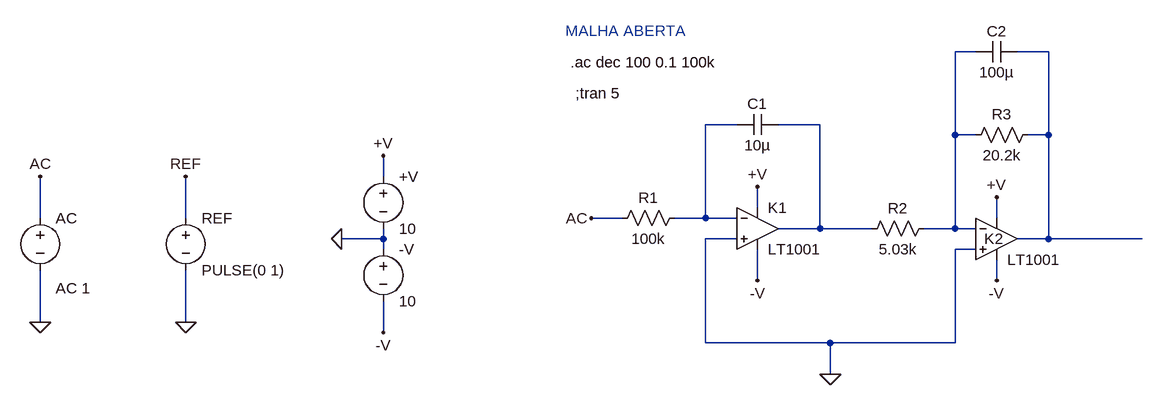
[diagram p0: schematic OL.asc]
OL.asc, the LTspice schematic file:
Version 4
SHEET 1 1780 680
WIRE 400 -64 368 -64
WIRE 512 -64 464 -64
WIRE 32 48 -16 48
WIRE 160 48 96 48
WIRE 368 64 368 -64
WIRE 400 64 368 64
WIRE 512 64 512 -64
WIRE 512 64 480 64
WIRE -512 128 -512 96
WIRE 64 176 64 144
WIRE -1040 192 -1040 128
WIRE -816 192 -816 128
WIRE -144 192 -192 192
WIRE -16 192 -16 48
WIRE -16 192 -64 192
WIRE 32 192 -16 192
WIRE 432 192 432 160
WIRE 160 208 160 48
WIRE 160 208 96 208
WIRE 240 208 160 208
WIRE 368 208 368 64
WIRE 368 208 320 208
WIRE 400 208 368 208
WIRE -512 224 -512 208
WIRE -512 224 -576 224
WIRE 32 224 -16 224
WIRE 512 224 512 64
WIRE 512 224 464 224
WIRE 656 224 512 224
WIRE -512 240 -512 224
WIRE 400 240 368 240
WIRE 64 288 64 240
WIRE 432 288 432 256
WIRE -1040 352 -1040 272
WIRE -816 352 -816 272
WIRE -512 368 -512 320
WIRE -16 384 -16 224
WIRE 176 384 -16 384
WIRE 368 384 368 240
WIRE 368 384 176 384
WIRE 176 432 176 384
FLAG -512 96 +V
FLAG -512 368 -V
FLAG -576 224 0
FLAG -816 352 0
FLAG -816 128 REF
FLAG -192 192 AC
FLAG 64 144 +V
FLAG 432 160 +V
FLAG 64 288 -V
FLAG 432 288 -V
FLAG 176 432 0
FLAG -1040 352 0
FLAG -1040 128 AC
SYMBOL voltage -512 112 R0
WINDOW 123 0 0 Left 2
WINDOW 39 0 0 Left 2
SYMATTR InstName +V
SYMATTR Value 10
SYMBOL voltage -512 224 R0
WINDOW 123 0 0 Left 2
WINDOW 39 0 0 Left 2
SYMATTR InstName -V
SYMATTR Value 10
SYMBOL voltage -816 176 R0
WINDOW 123 0 0 Left 2
WINDOW 39 0 0 Left 2
SYMATTR InstName REF
SYMATTR Value PULSE(0 1)
SYMBOL Opamps\\LT1001 64 144 R0
SYMATTR InstName K1
SYMBOL Opamps\\LT1001 432 160 R0
WINDOW 0 -19 64 Left 2
SYMATTR InstName K2
SYMBOL res -48 176 R90
WINDOW 0 0 56 VBottom 2
WINDOW 3 32 56 VTop 2
SYMATTR InstName R1
SYMATTR Value 100k
SYMBOL res 336 192 R90
WINDOW 0 0 56 VBottom 2
WINDOW 3 32 56 VTop 2
SYMATTR InstName R2
SYMATTR Value 5.03k
SYMBOL res 496 48 R90
WINDOW 0 0 56 VBottom 2
WINDOW 3 32 56 VTop 2
SYMATTR InstName R3
SYMATTR Value 20.2k
SYMBOL cap 464 -80 R90
WINDOW 0 0 32 VBottom 2
WINDOW 3 32 32 VTop 2
SYMATTR InstName C2
SYMATTR Value 100µ
SYMBOL cap 96 32 R90
WINDOW 0 0 32 VBottom 2
WINDOW 3 32 32 VTop 2
SYMATTR InstName C1
SYMATTR Value 10µ
SYMBOL voltage -1040 176 R0
WINDOW 123 24 124 Left 2
WINDOW 39 0 0 Left 2
SYMATTR Value2 AC 1
SYMATTR InstName AC
SYMATTR Value ""
TEXT -232 -96 Left 2 ;MALHA ABERTA
TEXT -216 0 Left 2 !;tran 5
TEXT -224 -48 Left 2 !.ac dec 100 0.1 100k

The netlist it stands for:
* OL.asc
V§+V +V 0 10
V§-V 0 -V 10
V§REF REF 0 PULSE(0 1)
XK1 0 N003 +V -V N004 LT1001  ; pins In+ In- V+ V- OUT
XK2 0 N001 +V -V N002 LT1001  ; pins In+ In- V+ V- OUT
R1 N003 AC 100k
R2 N001 N004 5.03k
R3 N002 N001 20.2k
C2 N002 N001 100µ
C1 N004 N003 10µ
V§AC AC 0 AC 1
* MALHA ABERTA
;tran 5
.ac dec 100 0.1 100k
.lib LTC.lib
.backanno
.end